# Altium schematic sheet Peripherals.SchDoc
size A; SheetNumber: 4; SheetTotal: 5
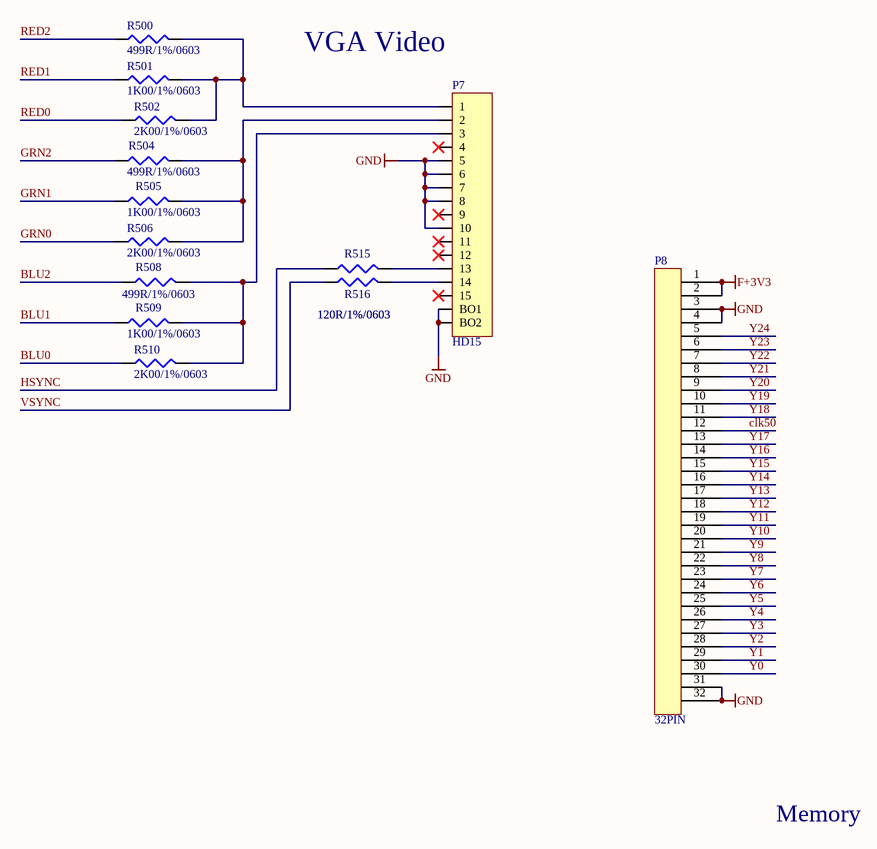
[diagram p0: Peripherals.SchDoc]

## Parts
P7  HD15  [DB15FLC]
P8  32PIN  [IDC32]
R500  499R/1%/0603  [0603]
R501  1K00/1%/0603  [0603]
R502  2K00/1%/0603  [0603]
R504  499R/1%/0603  [0603]
R505  1K00/1%/0603  [0603]
R506  2K00/1%/0603  [0603]
R508  499R/1%/0603  [0603]
R509  1K00/1%/0603  [0603]
R510  2K00/1%/0603  [0603]
R515  120R/1%/0603  [0603]
R516  120R/1%/0603  [0603]

## Nets
F+3V3: P8.1 P8.2
GND: P7.5 P7.6 P7.7 P7.8 P7.10 P7.BO1 P7.BO2 P8.3 P8.4 P8.31 P8.32
BLU0: R510.1
BLU1: R509.1
BLU2: R508.1
clk50: P8.12
GRN0: R506.1
GRN1: R505.1
GRN2: R504.1
HSYNC: R515.1
RED0: R502.1
RED1: R501.1
RED2: R500.1
VSYNC: R516.1
Y0: P8.30
Y1: P8.29
Y2: P8.28
Y3: P8.27
Y4: P8.26
Y5: P8.25
Y6: P8.24
Y7: P8.23
Y8: P8.22
Y9: P8.21
Y10: P8.20
Y11: P8.19
Y12: P8.18
Y13: P8.17
Y14: P8.16
Y15: P8.15
Y16: P8.14
Y17: P8.13
Y18: P8.11
Y19: P8.10
Y20: P8.9
Y21: P8.8
Y22: P8.7
Y23: P8.6
Y24: P8.5
NetP7_1: P7.1 R500.2 R501.2 R502.2
NetP7_2: P7.2 R504.2 R505.2 R506.2
NetP7_3: P7.3 R508.2 R509.2 R510.2
NetP7_13: P7.13 R515.2
NetP7_14: P7.14 R516.2

Not connected (* = marked no-connect by the designer): P7 4* 9* 11* 12* 15*

## Notes on the sheet
- (near P7) VGA Video
- Memory

## Library data of the parts
P7 = HD15: CONN DSUB HD RCPT 15POS R/A SLDR; Text Field1: Amphenol; Mfg PN: ICD15S13E4GX00LF; DK PN: 609-5181-ND
R500 R504 R508 = 499R/1%/0603: 499 Ohms ±1% 0.1W, 1/10W Chip Resistor 0603 (1608 Metric) Moisture Resistant Thick Film; MFG: Yeago; MFG PN: RC0603FR-07499RL; DK PN: 311-499HRCT-ND
R501 R505 R509 = 1K00/1%/0603: 1 kOhms ±1% 0.1W, 1/10W Chip Resistor 0603 (1608 Metric) Moisture Resistant Thick Film; MFG: Yeago; MFG PN: RC0603FR-071KL; DK PN: 311-1.00KHRCT-ND
R502 R506 R510 = 2K00/1%/0603: 2 kOhms ±1% 0.1W, 1/10W Chip Resistor 0603 (1608 Metric) Moisture Resistant Thick Film; MFG: Yeago; MFG PN: RC0603FR-072KL; DK PN: 311-2.00KHRCT-ND
R515 R516 = 120R/1%/0603: 120 Ohms ±1% 0.1W, 1/10W Chip Resistor 0603 (1608 Metric) Moisture Resistant Thick Film; MFG: Yaego; MFG PN: RC0603FR-07120RL; DK PN: 311-120HRCT-ND
P8 = 32PIN: MFG: *; MFG PN: *; DK PN: *; Price: *